# Altium schematic sheet 12V_VMOT_SUPPLY.SchDoc
size OrCAD C; SheetNumber: 8; SheetTotal: 12
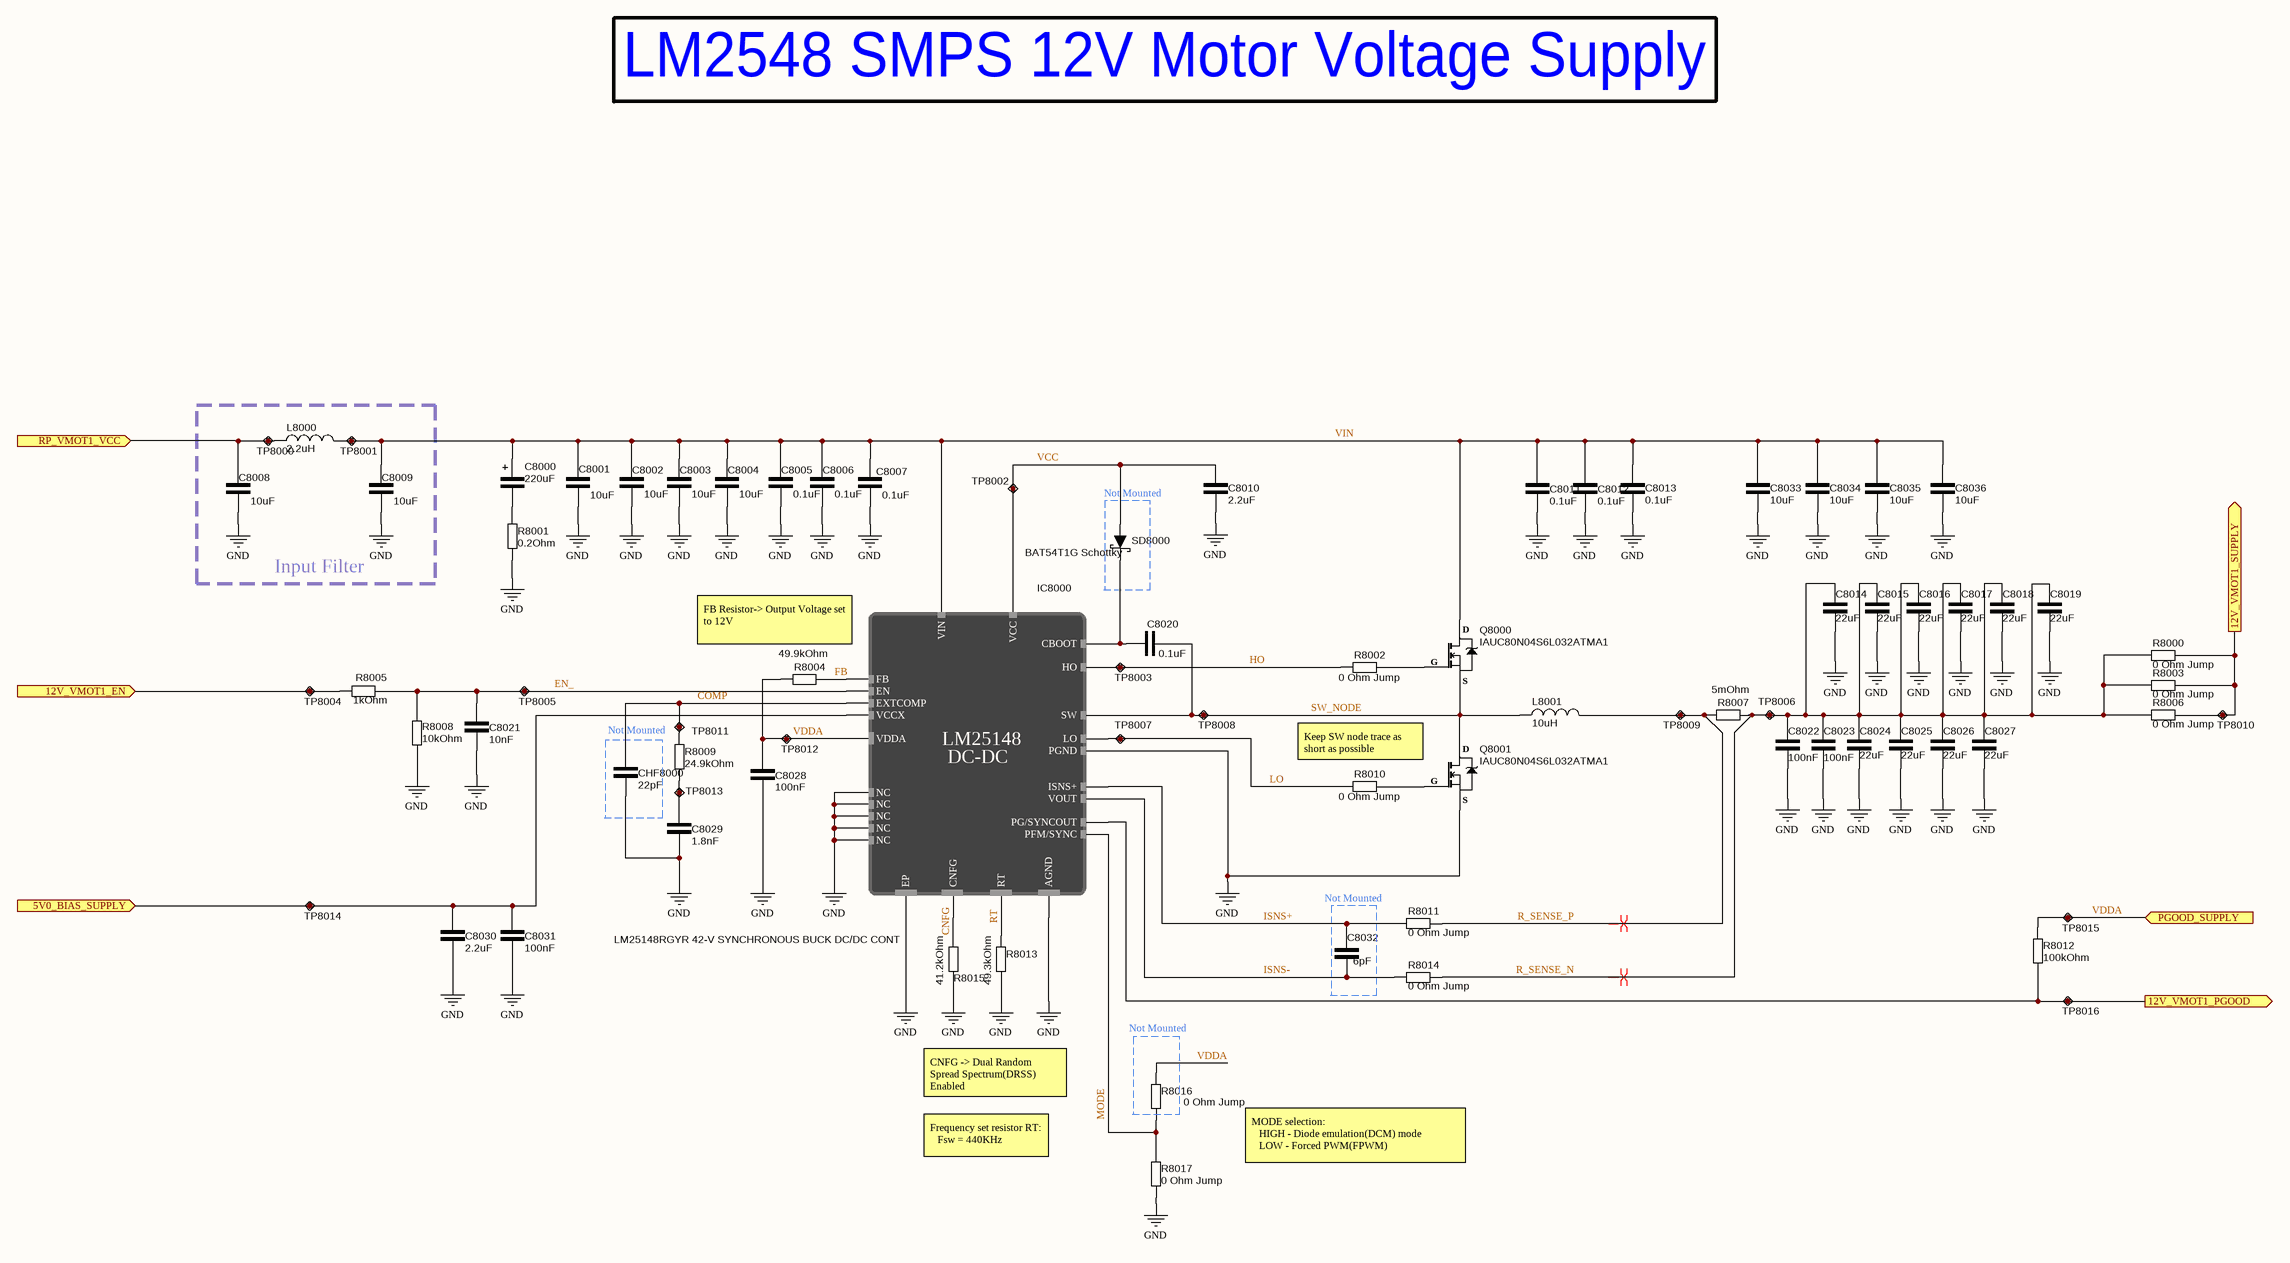
[diagram p0: 12V_VMOT_SUPPLY.SchDoc]

## Parts
C8000  220uF  [CAPAE109103X103M]
C8001  10uF  [CAP_1206]
C8002  10uF  [CAP_1206]
C8003  10uF  [CAP_1206]
C8004  10uF  [CAP_1206]
C8005  0.1uF  [CAP_0603]
C8006  0.1uF  [CAP_0603]
C8007  0.1uF  [CAP_0603]
C8008  10uF  [CAP_1206]
C8009  10uF  [CAP_1206]
C8010  2.2uF  [CAP_0603]
C8011  0.1uF  [CAP_0603]
C8012  0.1uF  [CAP_0603]
C8013  0.1uF  [CAP_0603]
C8014  22uF  [CAP_1210]
C8015  22uF  [CAP_1210]
C8016  22uF  [CAP_1210]
C8017  22uF  [CAP_1210]
C8018  22uF  [CAP_1210]
C8019  22uF  [CAP_1210]
C8020  0.1uF  [CAP_0603]
C8021  10nF  [CAP_0603]
C8022  100nF  [CAP_0603]
C8023  100nF  [CAP_0603]
C8024  22uF  [CAP_1210]
C8025  22uF  [CAP_1210]
C8026  22uF  [CAP_1210]
C8027  22uF  [CAP_1210]
C8028  100nF  [CAP_0603]
C8029  1.8nF  [CAP_0603]
C8030  2.2uF  [CAP_0603]
C8031  100nF  [CAP_0603]
C8032  6pF  [CAP_0402]
C8033  10uF  [CAP_1206]
C8034  10uF  [CAP_1206]
C8035  10uF  [CAP_1206]
C8036  10uF  [CAP_1206]
CHF8000  22pF  [CAP_0603]
IC8000  LM25148RGYR 42-V SYNCHRONOUS BUCK DC/DC CONT  [VQFN25_RGY_TEX]
L8000  2.2uH  [IHLP-3232DZ-51]
L8001  10uH  [INDP135126X65N]
Q8000  IAUC80N04S6L032ATMA1  [PG-TDSON-8-33]
Q8001  IAUC80N04S6L032ATMA1  [PG-TDSON-8-33]
R8000  0 Ohm Jump  [RES_1206]
R8001  0.2Ohm  [RES_1206]
R8002  0 Ohm Jump  [RES_0402]
R8003  0 Ohm Jump  [RES_1206]
R8004  49.9kOhm  [RES_0603]
R8005  1kOhm  [RES_0603]
R8006  0 Ohm Jump  [RES_1206]
R8007  5mOhm  [RES_1020_WIDE]
R8008  10kOhm  [RES_0603]
R8009  24.9kOhm  [RES_0603]
R8010  0 Ohm Jump  [RES_0402]
R8011  0 Ohm Jump  [RES_0402]
R8012  100kOhm  [RES_0603]
R8013  49.3kOhm  [RES_0603]
R8014  0 Ohm Jump  [RES_0402]
R8015  41.2kOhm  [RES_0603]
R8016  0 Ohm Jump  [RES_0603]
R8017  0 Ohm Jump  [RES_0603]
SD8000  BAT54T1G Schottky  [SODFL371X135-2N]
TP8000  Test point  [TestPoint]  (value not drawn)
TP8001  Test point  [TestPoint]  (value not drawn)
TP8002  Test point  [TestPoint]  (value not drawn)
TP8003  Test point  [TestPoint]  (value not drawn)
TP8004  Test point  [TestPoint]  (value not drawn)
TP8005  Test point  [TestPoint]  (value not drawn)
TP8006  Test point  [TestPoint]  (value not drawn)
TP8007  Test point  [TestPoint]  (value not drawn)
TP8008  Test point  [TestPoint]  (value not drawn)
TP8009  Test point  [TestPoint]  (value not drawn)
TP8010  Test point  [TestPoint]  (value not drawn)
TP8011  Test point  [TestPoint]  (value not drawn)
TP8012  Test point  [TestPoint]  (value not drawn)
TP8013  Test point  [TestPoint]  (value not drawn)
TP8014  Test point  [TestPoint]  (value not drawn)
TP8015  Test point  [TestPoint]  (value not drawn)
TP8016  Test point  [TestPoint]  (value not drawn)

## Blocks framed on the sheet
Input Filter: C8008 C8009 L8000 TP8000 TP8001
Not Mounted: SD8000
Not Mounted: CHF8000

## Ports
5V0_BIAS_SUPPLY (in, see 6DOF_CONTROLLER_Top[6A]), 12V_VMOT1_EN (in, see 6DOF_CONTROLLER_Top[6A]), 12V_VMOT1_PGOOD (out, see 6DOF_CONTROLLER_Top[7A]), 12V_VMOT1_SUPPLY (out, see 6DOF_CONTROLLER_Top[7A]), PGOOD_SUPPLY (in, see 6DOF_CONTROLLER_Top[6A], 3V3_SYS_SUPPLY[1C], 5V0_EXT_SUPPLY[1C]), RP_VMOT1_VCC (in, see 6DOF_CONTROLLER_Top[6A])

## Nets
GND: C8001.1 C8002.2 C8003.2 C8004.2 C8005.2 C8006.2 C8007.1 C8008.1 C8009.1 C8010.1 C8011.1 C8012.1 C8013.2 C8014.1 C8015.2 C8016.1 C8017.1 C8018.2 C8019.1 C8021.1 C8022.1 C8023.1 C8024.2 C8025.2 C8026.1 C8027.2 C8028.1 C8029.1 C8030.2 C8031.1 C8033.1 C8034.1 C8035.1 C8036.1 CHF8000.1 IC8000.1(NC) IC8000.2(NC) IC8000.7(AGND) IC8000.10(PGND) IC8000.22(NC) IC8000.23(NC) IC8000.24(NC) IC8000.25(EP) Q8001.S(Source) R8001.1 R8008.1 R8013.1 R8015.1 R8017.1
5V0_BIAS_SUPPLY: C8030.1 C8031.2 IC8000.16(VCCX) TP8014.1 ; port 5V0_BIAS_SUPPLY
12V_VMOT1_EN: R8005.1 TP8004.1 ; port 12V_VMOT1_EN
12V_VMOT1_PGOOD: IC8000.17(PG/SYNCOUT) R8012.1 TP8016.1 ; port 12V_VMOT1_PGOOD
12V_VMOT1_SUPPLY: R8000.2 R8003.2 R8006.2 TP8010.1 ; port 12V_VMOT1_SUPPLY
CNFG: IC8000.3(CNFG) R8015.2
COMP: CHF8000.2 IC8000.5(EXTCOMP) R8009.2 TP8011.1
EN_: C8021.2 IC8000.19(EN) R8005.2 R8008.2 TP8005.1
FB: IC8000.6(FB) R8004.2
HO: IC8000.13(HO) R8002.1 TP8003.1
ISNS+: C8032.2 IC8000.20(ISNS+) R8011.1
ISNS-: C8032.1 IC8000.21(VOUT) R8014.1
LO: IC8000.11(LO) R8010.1 TP8007.1
MODE: IC8000.18(PFM/SYNC) R8016.1 R8017.2
R_SENSE_N: C8014.2 C8015.1 C8016.2 C8017.2 C8018.1 C8019.2 C8022.2 C8023.2 C8024.1 C8025.1 C8026.2 C8027.1 R8000.1 R8003.1 R8006.1 R8007.2 R8014.2 TP8006.1
R_SENSE_P: L8001.2 R8007.1 R8011.2 TP8009.1
RP_VMOT1_VCC: C8008.2 L8000.1 TP8000.1 ; port RP_VMOT1_VCC
RT: IC8000.4(RT) R8013.2
SW_NODE: C8020.1 IC8000.14(SW) L8001.1 Q8000.S(Source) Q8001.D(Drain) TP8008.1
VCC: C8010.2 IC8000.9(VCC) SD8000.1(Anode) TP8002.1
VDDA: C8028.2 IC8000.8(VDDA) R8004.1 R8012.2 R8016.2 TP8012.1 TP8015.1 ; port PGOOD_SUPPLY
VIN: C8000.2 C8001.2 C8002.1 C8003.1 C8004.1 C8005.1 C8006.1 C8007.2 C8009.2 C8011.2 C8012.2 C8013.1 C8033.2 C8034.2 C8035.2 C8036.2 IC8000.12(VIN) L8000.2 Q8000.D(Drain) TP8001.1
NetC8000_1: C8000.1 R8001.2
NetC8020_2: C8020.2 IC8000.15(CBOOT) SD8000.2(Cathode)
NetC8029_2: C8029.2 R8009.1 TP8013.1
NetQ8000_G: Q8000.G(Gate) R8002.2
NetQ8001_G: Q8001.G(Gate) R8010.2

## Layout directives
differential pair: R_SENSE_N, R_SENSE_P

## Notes on the sheet
- LM2548 SMPS 12V Motor Voltage Supply
- (near IC8000) FB Resistor-> Output Voltage set to 12V
- Keep SW node trace as short as possible
- Not Mounted
- CNFG -> Dual Random Spread Spectrum(DRSS) Enabled
- Frequency set resistor RT:
  Fsw = 440KHz
- MODE selection:
  HIGH - Diode emulation(DCM) mode
  LOW - Forced PWM(FPWM)
- (in symbol LM25148RGYR) LM25148; DC-DC

## Library data of the parts
C8000 = C000033: 220 µF 35 V Aluminum - Polymer Capacitors Radial, Can - SMD 23mOhm 1000 Hrs @ 150°C; ComponentLink1Description: DigiKey; ComponentLink1URL: https://www.digikey.com/en/products/detail/kemet/A785MN227M1VLAS023/22003773?s=N4IgTCBcDaIIIHYAcBWAsgOTGBaCMAagDJwDKADGAMwgC6AvkA; DigiKey Part Number: 399-A785MN227M1VLAS023CT-ND; capacitance: 220uF
C8001-C8004 C8008 C8009 C8033-C8036 = C000017: 10 µF ±10% 50V Ceramic Capacitor X7R 1206 (3216 Metric); capacitance: 10uF; ComponentLink1Description: DigiKey; ComponentLink1URL: https://www.digikey.com/en/products/detail/samsung-electro-mechanics/CL31B106KBHNNNE/5961251; DigiKey Part Number: 1276-6767-1-ND
C8005-C8007 C8011-C8013 C8020 = C000018: 0.1 µF ±10% 50V Ceramic Capacitor X7R 0603 (1608 Metric); capacitance: 0.1uF; ComponentLink1Description: DigiKey; ComponentLink1URL: https://www.digikey.com/en/products/detail/samsung-electro-mechanics/CL10B104KB8NNNC/3886658; DigiKey Part Number: 1276-1000-1-ND
C8010 C8030 = C000014: 8 pF ±0.05pF 25V Ceramic Capacitor C0G, NP0 01005 (0402 Metric); ComponentLink1Description: DigiKey; ComponentLink1URL: https://www.digikey.com/en/products/detail/murata-electronics/GRM188C71C225KE11D/4905311; DigiKey Part Number: 490-12731-1-ND; capacitance: 2.2uF
C8014-C8019 C8024-C8027 = C000032: 22 µF ±10% 25V Ceramic Capacitor X7R 1210 (3225 Metric); DigiKey Part Number: 1276-3392-1-ND; ComponentLink1Description: DigiKey; ComponentLink1URL: https://www.digikey.com/en/products/detail/samsung-electro-mechanics/CL32B226KAJNNNE/3889050; capacitance: 22uF
C8021 = C000005: 10000 pF ±20% 25V Ceramic Capacitor X7R 0603 (1608 Metric); ComponentLink1Description: DigiKey; ComponentLink1URL: https://www.digikey.com/en/products/detail/kyocera-avx/06033C103MAT2A/1599370; capacitance: 10nF; DigiKey Part Number: 478-KGM15AR71E103MTCT-ND
C8022 C8023 C8028 C8031 = C000007: 0.1 µF ±10% 25V Ceramic Capacitor X7R 0603 (1608 Metric); ComponentLink1Description: DigiKey; ComponentLink1URL: https://www.digikey.com/en/products/detail/kyocera-avx/06033C104K4T2A/8019250; capacitance: 100nF; DigiKey Part Number: 478-KAM15AR71E104KTCT-ND
C8029 = C000027: 1800 pF ±10% 25V Ceramic Capacitor X7R 0603 (1608 Metric); ComponentLink1Description: DigiKey; ComponentLink1URL: https://www.digikey.com/en/products/detail/kemet/C0603C182K3RAC7867/2200107; DigiKey Part Number: 399-15370-1-ND; capacitance: 1.8nF
C8032 = C000016: 6 pF ±0.5pF 25V Ceramic Capacitor C0G, NP0 0402 (1005 Metric); DigiKey Part Number: 399-CBR04C609D3GACCT-ND; ComponentLink1Description: DigiKey; ComponentLink1URL: https://www.digikey.com/en/products/detail/kemet/CBR04C609D3GAC/18137865?s=N4IgjCBcpgLFoDGUBmBDANgZwKYBoQB7KAbXAFYBOAJlgHYQBdAgBwBcoQBlNgJwEsAdgHMQAXwJgAbAhDJI6bPiKkQAZkphyADiasOkbnyGiJIagAZYlWfMW4CxSGSkACFgDE9IdpwCqgvxsAPIoALI4aFgArrw44gQAtNS2UHzRyk5k5ExieUA; capacitance: 6pF
CHF8000 = C000024: 22 pF ±10% 25V Ceramic Capacitor X7R 0603 (1608 Metric); capacitance: 22pF; ComponentLink1Description: DigiKey; ComponentLink1URL: https://www.digikey.com/en/products/detail/kemet/C0603C220K3RACAUTO/16524857; DigiKey Part Number: 399-C0603C220K3RACAUTOCT-ND
IC8000 = LM25148RGYR: Buck Regulator Positive Output Step-Down DC-DC Controller IC 24-VQFN (5.5x3.5); DigiKey Part Number: 296-LM25148RGYRCT-ND; Mouser Part Number: 595-LM25148RGYR; ComponentLink1Description: DigiKey; ComponentLink1URL: https://www.digikey.com/en/products/detail/texas-instruments/LM25148RGYR/15857124; ComponentLink2Description: Mouser; ComponentLink2URL: https://eu.mouser.com/ProductDetail/Texas-Instruments/LM25148RGYR?qs=doiCPypUmgEViljGB5jAZw%3D%3D
L8000 = L000015: FIXED IND 2.2UH 11.5A 12.5 MOHM; inductance: 2.2uH; DigiKey Part Number: 541-IHLP3232DZER2R2M5ACT-ND; ComponentLink1Description: DigiKey; ComponentLink1URL: https://www.digikey.com/en/products/detail/vishay-dale/IHLP3232DZER2R2M5A/4070222; case: 3232; Mouser Part Number: 70-IHLP3232DZR2R2M5A; ComponentLink2Description: Mouser; ComponentLink2URL: https://eu.mouser.com/ProductDetail/Vishay-Dale/IHLP3232DZER2R2M5A?qs=tDDpbAIEejr3%252BeiaEh99%252Bg%3D%3D
L8001 = L000016: FIXED IND 10UH 11A 15.8 MOHM SMD; inductance: 10uH; DigiKey Part Number: 553-4029-1-ND; ComponentLink1Description: DigiKey; ComponentLink1URL: https://www.digikey.com/en/products/detail/pulse-electronics/PA4343-103ANLT/7943151?s=N4IgTCBcDaIAoEEAsBmVA6AjABhQgcgDIAqIAugL5A; case: 13.5x12.6; Mouser Part Number: 673-PA4343.103ANLT; ComponentLink2Description: Mouser; ComponentLink2URL: https://eu.mouser.com/ProductDetail/Pulse-Electronics/PA4343.103ANLT?qs=chTDxNqvsym%252BWuIQdh7qfw%3D%3D
Q8000 Q8001 = 00000008: N-Channel 40 V 80A (Tc) 50W (Tc) Surface Mount PG-TDSON-8; DigiKey Part Number: 448-IAUC80N04S6L032ATMA1CT-ND; Mouser Part Number: 726-IAUC80N04S6L032A; ComponentLink1Description: DigiKey; ComponentLink1URL: https://www.digikey.com/en/products/detail/infineon-technologies/IAUC80N04S6L032ATMA1/13677609; ComponentLink2Description: Mouser; ComponentLink2URL: https://eu.mouser.com/ProductDetail/Infineon-Technologies/IAUC80N04S6L032ATMA1?qs=BJlw7L4Cy7%2F3D%2F1wP9Fszw%3D%3D; ComponentLink3Description: Footprint Drawing; ComponentLink3URL: https://www.infineon.com/cms/en/product/packages/PG-TDSON/PG-TDSON-8-33/
R8000 R8003 R8006 = R000012: 0 Ohms Jumper Chip Resistor 1206 (3216 Metric) Automotive AEC-Q200 Thick Film; ComponentLink1Description: DigiKey; ComponentLink1URL: https://www.digikey.com/en/products/detail/stackpole-electronics-inc/RMCF1206ZT0R00/1756906; resistance: 0 Ohm Jump; DigiKey Part Number: RMCF1206ZT0R00CT-ND
R8001 = R000024: 200 mOhms ±1% 0.5W, 1/2W Chip Resistor 1206 (3216 Metric) Current Sense Thick Film; ComponentLink1Description: DigiKey; ComponentLink1URL: https://www.digikey.com/en/products/detail/stackpole-electronics-inc/CSR1206FKR200/1742391?s=N4IgTCBcDaIMIGUBKBGMAGAbAMQNJI3RAF0BfIA; resistance: 0.2Ohm; DigiKey Part Number: CSR1206FKR200CT-ND
R8002 R8010 R8011 R8014 = R000008: 0 Ohms Jumper Chip Resistor 0402 (1005 Metric) Automotive AEC-Q200 Thick Film; resistance: 0 Ohm Jump; DigiKey Part Number: P0.0JCT-ND; ComponentLink1Description: DigiKey; ComponentLink1URL: https://www.digikey.com/en/products/detail/panasonic-electronic-components/ERJ-2GE0R00X/146727
R8004 = R000025: 49.9 kOhms ±1% 0.1W, 1/10W Chip Resistor 0603 (1608 Metric) Moisture Resistant Thick Film; ComponentLink1Description: DigiKey; ComponentLink1URL: https://www.digikey.com/en/products/detail/yageo/RC0603FR-0749K9L/727265; resistance: 49.9kOhm; DigiKey Part Number: 311-49.9KHRCT-ND
R8005 = R000004: 1 kOhms ±1% 0.125W, 1/8W Chip Resistor 0603 (1608 Metric) Anti-Sulfur Thin Film; resistance: 1kOhm; ComponentLink1Description: DigiKey; ComponentLink1URL: https://www.digikey.com/en/products/detail/vishay-beyschlag-draloric-bc-components/MCT06030C1001FP500/2607821; DigiKey Part Number: MCT0603-1.00K-CFCT-ND
R8007 = R000026: 5 mOhms ±1% 2W Chip Resistor Wide 2010 (5025 Metric), 1020 Anti-Sulfur, Automotive AEC-Q200, Current Sense, Moisture Resistant, Pulse Withstanding Metal Element; ComponentLink1Description: DigiKey; ComponentLink1URL: https://www.digikey.com/en/products/detail/vishay-dale/WSL10205L000FEA/9758314; resistance: 5mOhm; DigiKey Part Number: 541-10046-1-ND
R8008 = R000001: 10 kOhms ±1% 0.125W, 1/8W Chip Resistor 0603 (1608 Metric) Anti-Sulfur Thin Film; resistance: 10kOhm; ComponentLink1Description: DigiKey; ComponentLink1URL: https://www.digikey.com/en/products/detail/vishay-beyschlag-draloric-bc-components/MCT06030C1002FP500/1850440; DigiKey Part Number: MCT0603-10.0K-CFCT-ND
R8009 = R000017: 24.9 kOhms ±1% 0.1W, 1/10W Chip Resistor 0603 (1608 Metric) Automotive AEC-Q200 Thick Film; ComponentLink1Description: DigiKey; ComponentLink1URL: https://www.digikey.com/en/products/detail/panasonic-electronic-components/ERJ-3EKF2492V/196236; resistance: 24.9kOhm; DigiKey Part Number: P24.9KHCT-ND
R8012 = R000006: 100 kOhms ±1% 0.1W, 1/10W Chip Resistor 0603 (1608 Metric) Automotive AEC-Q200 Thick Film; resistance: 100kOhm; ComponentLink1Description: DigiKey; ComponentLink1URL: https://www.digikey.com/en/products/detail/stackpole-electronics-inc/RMCF0603FG100K/1713543; DigiKey Part Number: RMCF0603FG100KCT-ND
R8013 = R000023: 49.3 kOhms ±0.1% 0.1W, 1/10W Chip Resistor 0603 (1608 Metric) Thin Film; ComponentLink1Description: DigiKey; ComponentLink1URL: https://www.digikey.com/en/products/detail/yageo/RT0603BRD0749K3L/5927964; resistance: 49.3kOhm; DigiKey Part Number: 13-RT0603BRD0749K3LCT-ND
R8015 = R000015: 41.2 kOhms ±1% 0.1W, 1/10W Chip Resistor 0603 (1608 Metric) Automotive AEC-Q200 Thick Film; ComponentLink1Description: DigiKey; ComponentLink1URL: https://www.digikey.com/en/products/detail/panasonic-electronic-components/ERJ-3EKF4122V/196347; resistance: 41.2kOhm; DigiKey Part Number: P41.2KHCT-ND
R8016 R8017 = R000007: 0 Ohms Jumper Chip Resistor 0603 (1608 Metric) Automotive AEC-Q200 Thick Film; ComponentLink1Description: DigiKey; ComponentLink1URL: https://www.digikey.com/en/products/detail/stackpole-electronics-inc/RMCF0603ZT0R00/1756908; resistance: 0 Ohm Jump; DigiKey Part Number: RMCF0603ZT0R00CT-ND
SD8000 = 00000009: Diode 30 V 200mA Surface Mount SOD-123; DigiKey Part Number: BAT54T1GOSCT-ND; ComponentLink1Description: DigiKey; ComponentLink1URL: https://www.digikey.com/en/products/detail/onsemi/BAT54T1G/918319
TP8000-TP8016 = TP002: Test point 1mm